# EAGLE design interlock_board (EAGLE 7.2.0)
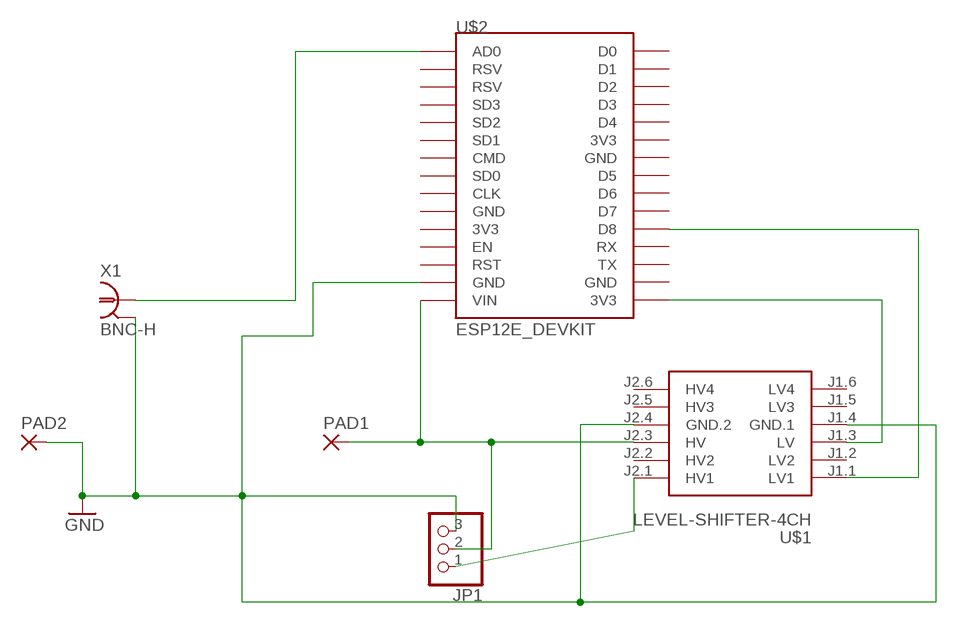
[diagram p0: schematic, sheet 1]

## Parts
JP1  PINHD-1X3  [1X03]
PAD1  2,54/0,9  [2,54/0,9]
PAD2  2,54/0,9  [2,54/0,9]
U$1  LEVEL-SHIFTER-4CH  [LEVEL-SHIFTER-4CH]
U$2  ESP12E_DEVKIT  [ESP12E_DEVKIT]
X1  BNC-H  [BNC90]

## Nets
GND: JP1.3 PAD2.1(P) U$1.J1.4(GND.1) U$1.J2.4(GND.2) U$2.GND@1(GND) X1.2
N$1: JP1.2 PAD1.1(P) U$1.J2.3(HV) U$2.VIN
N$2: U$1.J1.3(LV) U$2.3V3@2(3V3)
N$3: U$1.J1.1(LV1) U$2.D8
N$4: U$2.AD0 X1.1
N$6: JP1.1 U$1.J2.1(HV1)
Unconnected: U$1.J1.2(LV2) U$1.J1.5(LV3) U$1.J1.6(LV4) U$1.J2.2(HV2) U$1.J2.5(HV3) U$1.J2.6(HV4) U$2.3V3@0(3V3) U$2.3V3@1(3V3) U$2.CLK U$2.CMD U$2.D0 U$2.D1 U$2.D2 U$2.D3 U$2.D4 U$2.D5 U$2.D6 U$2.D7 U$2.EN U$2.GND@0(GND) U$2.GND@2(GND) U$2.GND@3(GND) U$2.RST U$2.RSV@0(RSV) U$2.RSV@1(RSV) U$2.RX U$2.SD0 U$2.SD1 U$2.SD2 U$2.SD3 U$2.TX

## Library data of the parts
JP1 = pinhead:PINHD-1X3: PIN HEADER
PAD1 PAD2 = wirepad:2,54/0,9: THROUGH-HOLE PAD
U$1 = diy-modules:LEVEL-SHIFTER-4CH: 4-Channel Bi-Directional Logic Level Converter based on BSS128 transistors Click here to find device on ebay.com <http://www.ebay.com/sch/i2c+logic+converter+module>
U$2 = interlock_board:ESP12E_DEVKIT: ESP12E DEVKIT BOARD
X1 = connector-jqi:BNC: BNC Connector.; DIGIKEY: A32260-ND

## Board
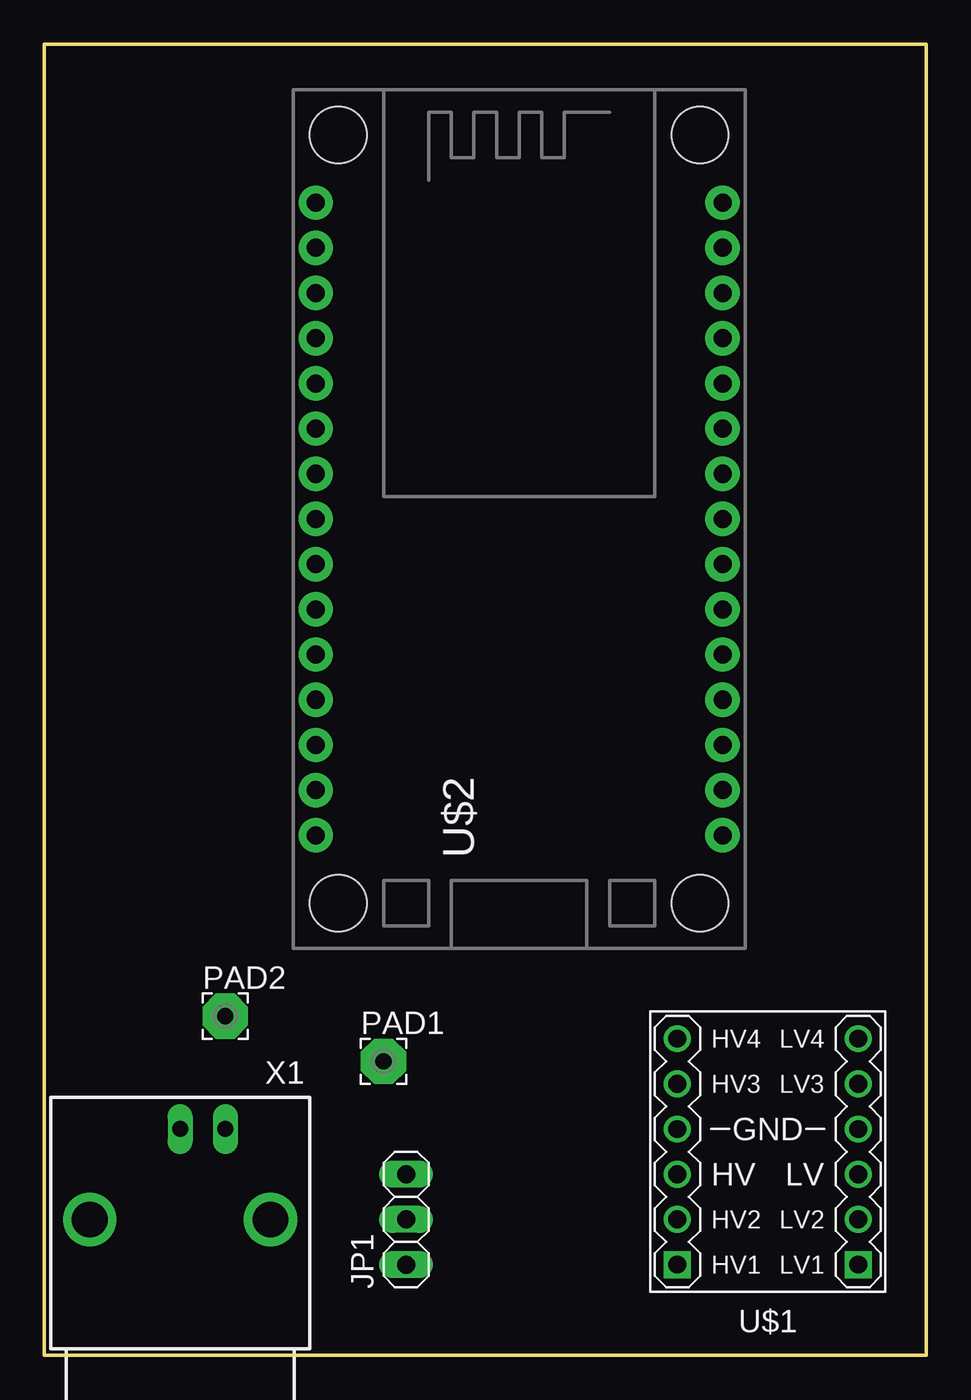
[diagram p1: board, top side]
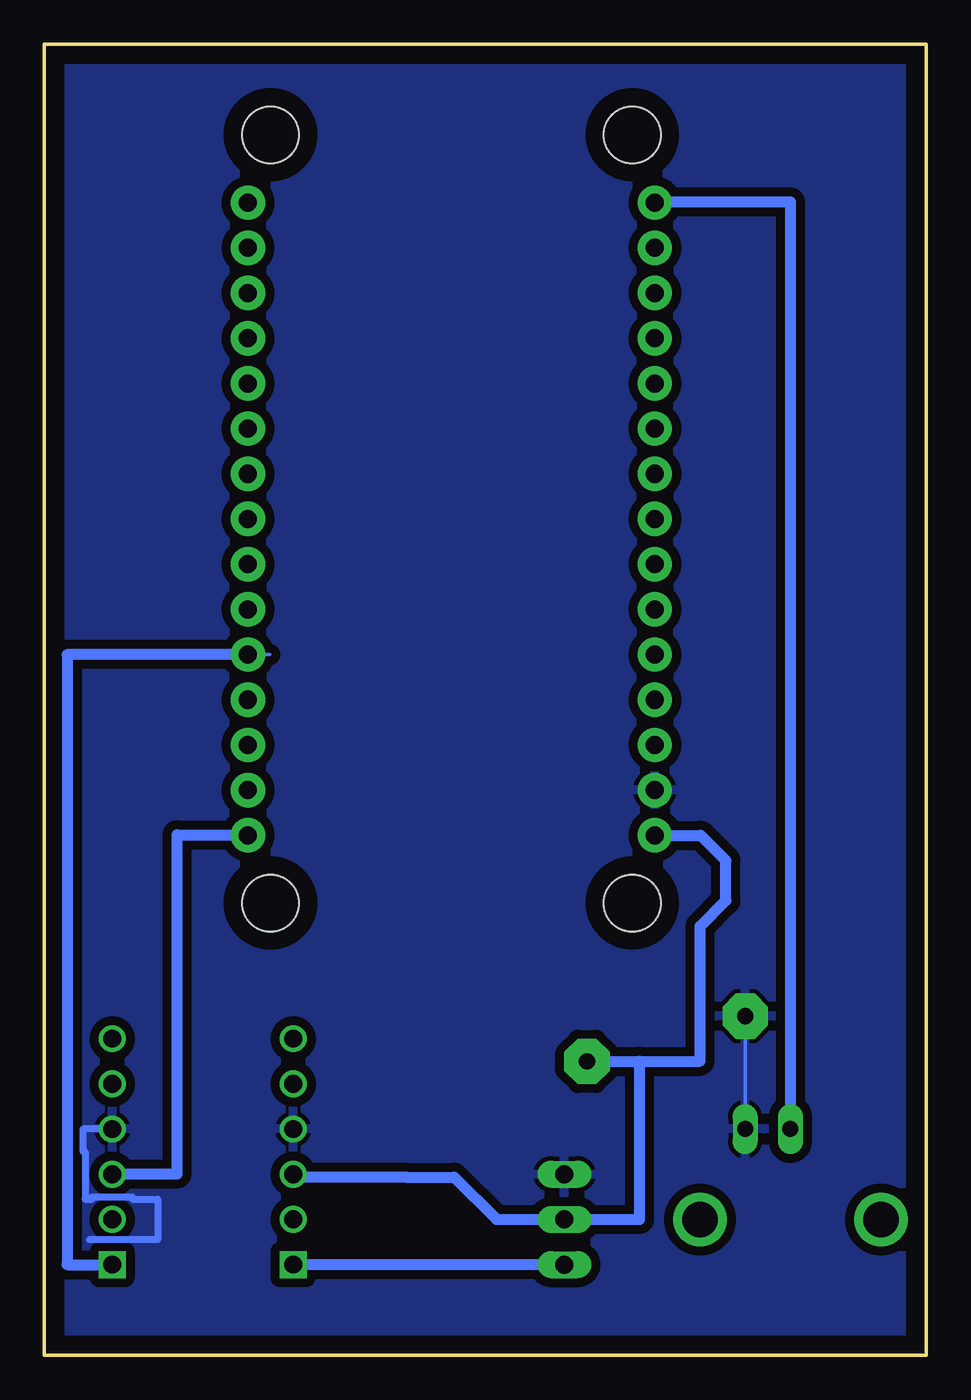
[diagram p2: board, bottom side, seen from below]

Size 49.53 x 73.66 mm. Coordinates in mm from the lower left corner, seen from the top.
Outline: 0,0 0,73.66 49.53,73.66 49.53,0 0,0
Copper layers (1*16): Top 0.035mm / dielectric 1.5mm / Bottom 0.035mm
Design rules "default": minimum track width 6mil, minimum drill 0.35mm, track to track 6mil, track to pad 6mil, pad to pad 6mil, via to via 6mil, smd to smd 6mil, copper to edge 40mil, drill to drill 6mil, minimum pad ring 10mil, minimum via ring 8mil, stop-mask expansion 4mil, vias tented up to drill 0mil, thermal gap 10mil

### Footprints (pad centres in the part's own frame; a part is rotated, then mirrored left to right if it is on the bottom)
1X03 = drill 1.016 long: 1 -2.54,0; 2 0,0; 3 2.54,0
2,54/0,9 = drill 0.914 pad 2.54 octagon: 1 0,0
LEVEL-SHIFTER-4CH = drill 1 square: J1.1 -5.08,6.35; J2.1 5.08,6.35 | drill 1: J1.2 -5.08,3.81; J1.3 -5.08,1.27; J1.4 -5.08,-1.27; J1.5 -5.08,-3.81; J1.6 -5.08,-6.35; J2.2 5.08,3.81; J2.3 5.08,1.27; J2.4 5.08,-1.27; J2.5 5.08,-3.81; J2.6 5.08,-6.35
ESP12E_DEVKIT = drill 1.016 pad 1.93: 3V3@0 -11.43,-7.62; 3V3@1 11.43,5.08; 3V3@2 11.43,-17.78; AD0 -11.43,17.78; CLK -11.43,-2.54; CMD -11.43,2.54; D0 11.43,17.78; D1 11.43,15.24; D2 11.43,12.7; D3 11.43,10.16; D4 11.43,7.62; D5 11.43,0; D6 11.43,-2.54; D7 11.43,-5.08; D8 11.43,-7.62; EN -11.43,-10.16; GND@0 -11.43,-5.08; GND@1 -11.43,-15.24; GND@2 11.43,2.54; GND@3 11.43,-15.24; RST -11.43,-12.7; RSV@0 -11.43,15.24; RSV@1 -11.43,12.7; RX 11.43,-10.16; SD0 -11.43,0; SD1 -11.43,5.08; SD2 -11.43,7.62; SD3 -11.43,10.16; TX 11.43,-12.7; VIN -11.43,-17.78 | hole 3.2: -10.16,21.59; 10.16,21.59; 10.16,-21.59; -10.16,-21.59
BNC90 = drill 0.9 pad 1.27 long: 1 0,-5.08; 2 -2.54,-5.08 | drill 2 pad 2.032: ANCHOR1 -5.08,0; ANCHOR2 5.08,0

### Placement (x,y rotation side)
JP1  20.32,7.62 90 top
PAD1  19.05,16.51 0 top
PAD2  10.16,19.05 0 top
U$1  40.64,11.43 180 top
U$2  26.67,46.99 0 top
X1  7.62,7.62 180 top

### Tracks (layer width: path | path; a pad name or v marks a point on that pad's centre or on a via)
GND
  Bottom 0.203: X1.2 PAD2.1
  Bottom 0.406: U$1.J1.4 47.37,12.7 47.37,11.43 47.24,11.43 47.24,8.76 46.86,8.76 46.86,8.89 44.58,8.89 44.58,8.76 43.18,8.76 43.18,6.48 46.99,6.48
  pour Bottom (isolate 0.508): 0,0 0,73.66 49.53,73.66 49.53,0
N$1
  Bottom 0.152: 12.7,29.21 12.68,29.23
  Bottom 0.203: 12.68,29.23 12.7,29.24
  Bottom 0.406: 35.56,10 U$1.J2.3
  Bottom 0.61: 16.09,16.51 16.09,7.62 JP1.2 24.13,7.62 26.51,10 29.21,10 35.56,10 | 12.68,29.23 11.25,27.8 11.25,25.54 12.7,24.1 12.7,16.51 16.09,16.51 | PAD1.1 16.09,16.51 | U$2.VIN 12.7,29.21
N$2
  Bottom 0.203: U$2.3V3@2 38.13,29.24
  Bottom 0.61: 38.13,29.24 42.09,29.24 42.09,10.16 U$1.J1.3
N$3
  Bottom 0.203: U$2.D8 36.88,39.37
  Bottom 0.61: U$2.D8 48.26,39.37 48.26,5.08 U$1.J1.1
N$4
  Bottom 0.203: U$2.AD0 15.24,64.82
  Bottom 0.61: X1.1 7.62,64.82 15.24,64.82
N$6
  Bottom 0.61: JP1.1 U$1.J2.1